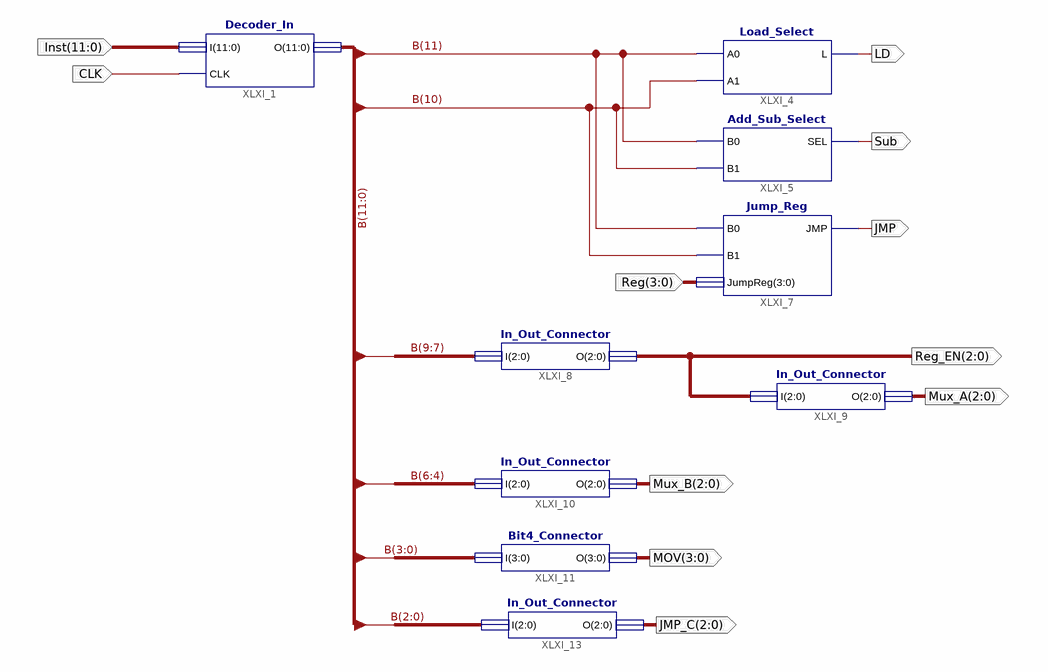
[diagram p0: schematic sheet 1]
// Xilinx ISE schematic Instruction_Decoder.sch (spartan3e) as structural Verilog: 9 symbols, 11 ports
module Instruction_Decoder (
  input  [11:0] Inst,
  input  CLK,
  input  [3:0] Reg,
  output [2:0] Reg_EN,
  output [2:0] Mux_A,
  output [2:0] Mux_B,
  output JMP,
  output LD,
  output Sub,
  output [3:0] MOV,
  output [2:0] JMP_C
);

  wire [11:0] B;

  Decoder_In XLXI_1 (.CLK(CLK), .I(Inst), .O(B));
  Load_Select XLXI_4 (.A0(B[11]), .A1(B[10]), .L(LD));
  Add_Sub_Select XLXI_5 (.B0(B[11]), .B1(B[10]), .SEL(Sub));
  Jump_Reg XLXI_7 (.B0(B[11]), .B1(B[10]), .JMP(JMP), .JumpReg(Reg));
  In_Out_Connector XLXI_8 (.I(B[9:7]), .O(Reg_EN));
  In_Out_Connector XLXI_9 (.I(Reg_EN), .O(Mux_A));
  In_Out_Connector XLXI_10 (.I(B[6:4]), .O(Mux_B));
  Bit4_Connector XLXI_11 (.I(B[3:0]), .O(MOV));
  In_Out_Connector XLXI_13 (.I(B[2:0]), .O(JMP_C));
endmodule
